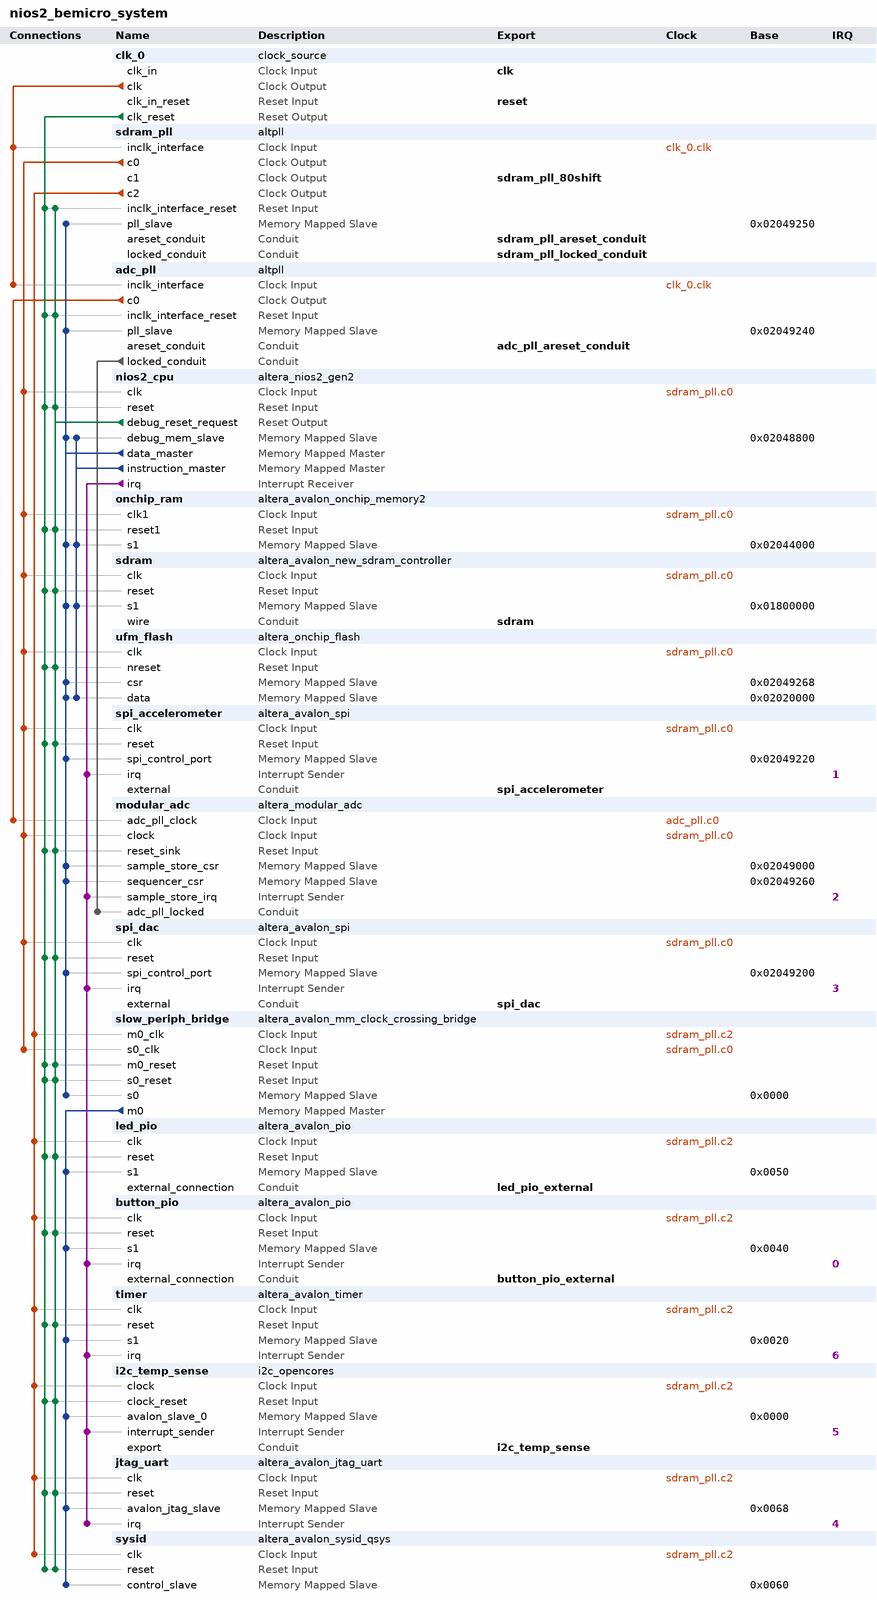
[diagram p0: system contents]
# Platform Designer (Qsys) system nios2_bemicro_system, MAX 10 10M08DAF484C8GES
# Parameters at their usual value, and those the tool derives, are not listed.
package require -exact qsys 16.0
create_system nios2_bemicro_system
set_project_property DEVICE_FAMILY {MAX 10}
set_project_property DEVICE 10M08DAF484C8GES

add_instance clk_0 clock_source 16.0
set_instance_parameter_value clk_0 clockFrequency 50000000

add_instance sdram_pll altpll 16.0
set_instance_parameter_value sdram_pll CLK0_DIVIDE_BY 5
set_instance_parameter_value sdram_pll CLK0_MULTIPLY_BY 8
set_instance_parameter_value sdram_pll CLK1_DIVIDE_BY 5
set_instance_parameter_value sdram_pll CLK1_DUTY_CYCLE 50
set_instance_parameter_value sdram_pll CLK1_MULTIPLY_BY 8
set_instance_parameter_value sdram_pll CLK1_PHASE_SHIFT -3125
set_instance_parameter_value sdram_pll CLK2_DIVIDE_BY 5
set_instance_parameter_value sdram_pll CLK2_DUTY_CYCLE 50
set_instance_parameter_value sdram_pll CLK2_MULTIPLY_BY 4
set_instance_parameter_value sdram_pll CLK2_PHASE_SHIFT 0
set_instance_parameter_value sdram_pll INCLK0_INPUT_FREQUENCY 20000
set_instance_parameter_value sdram_pll PORT_ARESET PORT_USED
set_instance_parameter_value sdram_pll PORT_LOCKED PORT_USED
set_instance_parameter_value sdram_pll PORT_clk1 PORT_USED
set_instance_parameter_value sdram_pll PORT_clk2 PORT_USED
set_instance_parameter_value sdram_pll PORT_clk3 PORT_UNUSED

add_instance adc_pll altpll 16.0
set_instance_parameter_value adc_pll CLK0_DIVIDE_BY 5
set_instance_parameter_value adc_pll CLK0_MULTIPLY_BY 1
set_instance_parameter_value adc_pll INCLK0_INPUT_FREQUENCY 20000
set_instance_parameter_value adc_pll PORT_ARESET PORT_USED
set_instance_parameter_value adc_pll PORT_LOCKED PORT_USED
set_instance_parameter_value adc_pll PORT_clk1 PORT_UNUSED
set_instance_parameter_value adc_pll PORT_clk2 PORT_UNUSED
set_instance_parameter_value adc_pll PORT_clk3 PORT_UNUSED

add_instance nios2_cpu altera_nios2_gen2 16.0
set_instance_parameter_value nios2_cpu dcache_size 2048
set_instance_parameter_value nios2_cpu debug_hwbreakpoint 2
set_instance_parameter_value nios2_cpu exceptionSlave onchip_ram.s1
set_instance_parameter_value nios2_cpu icache_size 4096
set_instance_parameter_value nios2_cpu impl Tiny
set_instance_parameter_value nios2_cpu resetSlave onchip_ram.s1

add_instance onchip_ram altera_avalon_onchip_memory2 16.0
set_instance_parameter_value onchip_ram dataWidth 32
set_instance_parameter_value onchip_ram dualPort false
set_instance_parameter_value onchip_ram initMemContent false
set_instance_parameter_value onchip_ram initializationFileName onchip_mem.hex
set_instance_parameter_value onchip_ram memorySize 16384

add_instance sdram altera_avalon_new_sdram_controller 16.0
set_instance_parameter_value sdram TAC 5.4
set_instance_parameter_value sdram TRCD 15.0
set_instance_parameter_value sdram TRP 15.0
set_instance_parameter_value sdram casLatency 2
set_instance_parameter_value sdram columnWidth 8
set_instance_parameter_value sdram dataWidth 16
set_instance_parameter_value sdram generateSimulationModel false
set_instance_parameter_value sdram model single_Micron_MT48LC4M32B2_7_chip
set_instance_parameter_value sdram numberOfBanks 4
set_instance_parameter_value sdram numberOfChipSelects 1
set_instance_parameter_value sdram powerUpDelay 100.0
set_instance_parameter_value sdram refreshPeriod 15.625
set_instance_parameter_value sdram rowWidth 12

add_instance ufm_flash altera_onchip_flash 16.0
set_instance_parameter_value ufm_flash CLOCK_FREQUENCY 80.0
set_instance_parameter_value ufm_flash CONFIGURATION_MODE {Single Uncompressed Image}
set_instance_parameter_value ufm_flash SECTOR_ACCESS_MODE {Read and write,Read and write,Read only,Hidden,Hidden}
set_instance_parameter_value ufm_flash initFlashContent false
set_instance_parameter_value ufm_flash initializationFileName altera_onchip_flash.hex
set_instance_parameter_value ufm_flash useNonDefaultInitFile false

add_instance spi_accelerometer altera_avalon_spi 16.0
set_instance_parameter_value spi_accelerometer clockPolarity 0
set_instance_parameter_value spi_accelerometer dataWidth 8
set_instance_parameter_value spi_accelerometer masterSPI true
set_instance_parameter_value spi_accelerometer numberOfSlaves 1
set_instance_parameter_value spi_accelerometer targetClockRate 128000

add_instance modular_adc altera_modular_adc 16.0
set_instance_parameter_value modular_adc CLOCK_FREQ 80000000
set_instance_parameter_value modular_adc CORE_VAR 0
set_instance_parameter_value modular_adc DEVICE_PART 10M08DAF484C8GES
set_instance_parameter_value modular_adc clkdiv 2
set_instance_parameter_value modular_adc int_vref_vr 3.0
set_instance_parameter_value modular_adc refsel 0
set_instance_parameter_value modular_adc sample_rate 0
set_instance_parameter_value modular_adc seq_order_length 8
set_instance_parameter_value modular_adc seq_order_slot_1 1
set_instance_parameter_value modular_adc seq_order_slot_2 9
set_instance_parameter_value modular_adc seq_order_slot_3 2
set_instance_parameter_value modular_adc seq_order_slot_4 16
set_instance_parameter_value modular_adc seq_order_slot_5 3
set_instance_parameter_value modular_adc seq_order_slot_6 11
set_instance_parameter_value modular_adc seq_order_slot_7 4
set_instance_parameter_value modular_adc seq_order_slot_8 12
set_instance_parameter_value modular_adc use_ch0 false
set_instance_parameter_value modular_adc use_ch11 true
set_instance_parameter_value modular_adc use_ch12 true
set_instance_parameter_value modular_adc use_ch16 true
set_instance_parameter_value modular_adc use_ch2 true
set_instance_parameter_value modular_adc use_ch3 true
set_instance_parameter_value modular_adc use_ch4 true
set_instance_parameter_value modular_adc use_ch5 false
set_instance_parameter_value modular_adc use_ch6 false
set_instance_parameter_value modular_adc use_ch7 false
set_instance_parameter_value modular_adc use_ch8 false
set_instance_parameter_value modular_adc use_ch9 true
set_instance_parameter_value modular_adc use_tsd false

add_instance spi_dac altera_avalon_spi 16.0
set_instance_parameter_value spi_dac clockPolarity 0
set_instance_parameter_value spi_dac dataWidth 8
set_instance_parameter_value spi_dac masterSPI true
set_instance_parameter_value spi_dac numberOfSlaves 1
set_instance_parameter_value spi_dac targetClockRate 128000

add_instance slow_periph_bridge altera_avalon_mm_clock_crossing_bridge 16.0
set_instance_parameter_value slow_periph_bridge ADDRESS_UNITS WORDS
set_instance_parameter_value slow_periph_bridge ADDRESS_WIDTH 10
set_instance_parameter_value slow_periph_bridge COMMAND_FIFO_DEPTH 8
set_instance_parameter_value slow_periph_bridge DATA_WIDTH 32
set_instance_parameter_value slow_periph_bridge MASTER_SYNC_DEPTH 2
set_instance_parameter_value slow_periph_bridge MAX_BURST_SIZE 1
set_instance_parameter_value slow_periph_bridge RESPONSE_FIFO_DEPTH 32
set_instance_parameter_value slow_periph_bridge SLAVE_SYNC_DEPTH 2
set_instance_parameter_value slow_periph_bridge USE_AUTO_ADDRESS_WIDTH 0

add_instance led_pio altera_avalon_pio 16.0
set_instance_parameter_value led_pio direction Output
set_instance_parameter_value led_pio width 8

add_instance button_pio altera_avalon_pio 16.0
set_instance_parameter_value button_pio captureEdge true
set_instance_parameter_value button_pio direction Input
set_instance_parameter_value button_pio edgeType FALLING
set_instance_parameter_value button_pio generateIRQ true
set_instance_parameter_value button_pio irqType EDGE
set_instance_parameter_value button_pio simDoTestBenchWiring true
set_instance_parameter_value button_pio simDrivenValue 15
set_instance_parameter_value button_pio width 4

add_instance timer altera_avalon_timer 16.0
set_instance_parameter_value timer period 1
set_instance_parameter_value timer periodUnits MSEC

add_instance i2c_temp_sense i2c_opencores 13.0

add_instance jtag_uart altera_avalon_jtag_uart 16.0
set_instance_parameter_value jtag_uart simInteractiveOptions NO_INTERACTIVE_WINDOWS

add_instance sysid altera_avalon_sysid_qsys 16.0
set_instance_parameter_value sysid id 0

# connections
add_connection adc_pll.c0 modular_adc.adc_pll_clock clock
add_connection clk_0.clk adc_pll.inclk_interface clock
add_connection clk_0.clk sdram_pll.inclk_interface clock
add_connection sdram_pll.c0 modular_adc.clock clock
add_connection sdram_pll.c0 nios2_cpu.clk clock
add_connection sdram_pll.c0 onchip_ram.clk1 clock
add_connection sdram_pll.c0 sdram.clk clock
add_connection sdram_pll.c0 slow_periph_bridge.s0_clk clock
add_connection sdram_pll.c0 spi_accelerometer.clk clock
add_connection sdram_pll.c0 spi_dac.clk clock
add_connection sdram_pll.c0 ufm_flash.clk clock
add_connection sdram_pll.c2 button_pio.clk clock
add_connection sdram_pll.c2 i2c_temp_sense.clock clock
add_connection sdram_pll.c2 jtag_uart.clk clock
add_connection sdram_pll.c2 led_pio.clk clock
add_connection sdram_pll.c2 slow_periph_bridge.m0_clk clock
add_connection sdram_pll.c2 sysid.clk clock
add_connection sdram_pll.c2 timer.clk clock
add_connection clk_0.clk_reset adc_pll.inclk_interface_reset reset
add_connection clk_0.clk_reset button_pio.reset reset
add_connection clk_0.clk_reset i2c_temp_sense.clock_reset reset
add_connection clk_0.clk_reset jtag_uart.reset reset
add_connection clk_0.clk_reset led_pio.reset reset
add_connection clk_0.clk_reset modular_adc.reset_sink reset
add_connection clk_0.clk_reset nios2_cpu.reset reset
add_connection clk_0.clk_reset onchip_ram.reset1 reset
add_connection clk_0.clk_reset sdram.reset reset
add_connection clk_0.clk_reset sdram_pll.inclk_interface_reset reset
add_connection clk_0.clk_reset slow_periph_bridge.m0_reset reset
add_connection clk_0.clk_reset slow_periph_bridge.s0_reset reset
add_connection clk_0.clk_reset spi_accelerometer.reset reset
add_connection clk_0.clk_reset spi_dac.reset reset
add_connection clk_0.clk_reset sysid.reset reset
add_connection clk_0.clk_reset timer.reset reset
add_connection clk_0.clk_reset ufm_flash.nreset reset
add_connection nios2_cpu.debug_reset_request adc_pll.inclk_interface_reset reset
add_connection nios2_cpu.debug_reset_request button_pio.reset reset
add_connection nios2_cpu.debug_reset_request i2c_temp_sense.clock_reset reset
add_connection nios2_cpu.debug_reset_request jtag_uart.reset reset
add_connection nios2_cpu.debug_reset_request led_pio.reset reset
add_connection nios2_cpu.debug_reset_request modular_adc.reset_sink reset
add_connection nios2_cpu.debug_reset_request nios2_cpu.reset reset
add_connection nios2_cpu.debug_reset_request onchip_ram.reset1 reset
add_connection nios2_cpu.debug_reset_request sdram.reset reset
add_connection nios2_cpu.debug_reset_request sdram_pll.inclk_interface_reset reset
add_connection nios2_cpu.debug_reset_request slow_periph_bridge.m0_reset reset
add_connection nios2_cpu.debug_reset_request slow_periph_bridge.s0_reset reset
add_connection nios2_cpu.debug_reset_request spi_accelerometer.reset reset
add_connection nios2_cpu.debug_reset_request spi_dac.reset reset
add_connection nios2_cpu.debug_reset_request sysid.reset reset
add_connection nios2_cpu.debug_reset_request timer.reset reset
add_connection nios2_cpu.debug_reset_request ufm_flash.nreset reset
add_connection nios2_cpu.data_master adc_pll.pll_slave avalon
set_connection_parameter_value nios2_cpu.data_master/adc_pll.pll_slave baseAddress 0x02049240
add_connection nios2_cpu.data_master modular_adc.sample_store_csr avalon
set_connection_parameter_value nios2_cpu.data_master/modular_adc.sample_store_csr baseAddress 0x02049000
add_connection nios2_cpu.data_master modular_adc.sequencer_csr avalon
set_connection_parameter_value nios2_cpu.data_master/modular_adc.sequencer_csr baseAddress 0x02049260
add_connection nios2_cpu.data_master nios2_cpu.debug_mem_slave avalon
set_connection_parameter_value nios2_cpu.data_master/nios2_cpu.debug_mem_slave baseAddress 0x02048800
add_connection nios2_cpu.data_master onchip_ram.s1 avalon
set_connection_parameter_value nios2_cpu.data_master/onchip_ram.s1 baseAddress 0x02044000
add_connection nios2_cpu.data_master sdram.s1 avalon
set_connection_parameter_value nios2_cpu.data_master/sdram.s1 baseAddress 0x01800000
add_connection nios2_cpu.data_master sdram_pll.pll_slave avalon
set_connection_parameter_value nios2_cpu.data_master/sdram_pll.pll_slave baseAddress 0x02049250
add_connection nios2_cpu.data_master slow_periph_bridge.s0 avalon
set_connection_parameter_value nios2_cpu.data_master/slow_periph_bridge.s0 baseAddress 0x0000
add_connection nios2_cpu.data_master spi_accelerometer.spi_control_port avalon
set_connection_parameter_value nios2_cpu.data_master/spi_accelerometer.spi_control_port baseAddress 0x02049220
add_connection nios2_cpu.data_master spi_dac.spi_control_port avalon
set_connection_parameter_value nios2_cpu.data_master/spi_dac.spi_control_port baseAddress 0x02049200
add_connection nios2_cpu.data_master ufm_flash.csr avalon
set_connection_parameter_value nios2_cpu.data_master/ufm_flash.csr baseAddress 0x02049268
add_connection nios2_cpu.data_master ufm_flash.data avalon
set_connection_parameter_value nios2_cpu.data_master/ufm_flash.data baseAddress 0x02020000
add_connection nios2_cpu.instruction_master nios2_cpu.debug_mem_slave avalon
set_connection_parameter_value nios2_cpu.instruction_master/nios2_cpu.debug_mem_slave baseAddress 0x02048800
add_connection nios2_cpu.instruction_master onchip_ram.s1 avalon
set_connection_parameter_value nios2_cpu.instruction_master/onchip_ram.s1 baseAddress 0x02044000
add_connection nios2_cpu.instruction_master sdram.s1 avalon
set_connection_parameter_value nios2_cpu.instruction_master/sdram.s1 baseAddress 0x01800000
add_connection nios2_cpu.instruction_master ufm_flash.data avalon
set_connection_parameter_value nios2_cpu.instruction_master/ufm_flash.data baseAddress 0x02020000
add_connection slow_periph_bridge.m0 button_pio.s1 avalon
set_connection_parameter_value slow_periph_bridge.m0/button_pio.s1 baseAddress 0x0040
add_connection slow_periph_bridge.m0 i2c_temp_sense.avalon_slave_0 avalon
set_connection_parameter_value slow_periph_bridge.m0/i2c_temp_sense.avalon_slave_0 baseAddress 0x0000
add_connection slow_periph_bridge.m0 jtag_uart.avalon_jtag_slave avalon
set_connection_parameter_value slow_periph_bridge.m0/jtag_uart.avalon_jtag_slave baseAddress 0x0068
add_connection slow_periph_bridge.m0 led_pio.s1 avalon
set_connection_parameter_value slow_periph_bridge.m0/led_pio.s1 baseAddress 0x0050
add_connection slow_periph_bridge.m0 sysid.control_slave avalon
set_connection_parameter_value slow_periph_bridge.m0/sysid.control_slave baseAddress 0x0060
add_connection slow_periph_bridge.m0 timer.s1 avalon
set_connection_parameter_value slow_periph_bridge.m0/timer.s1 baseAddress 0x0020
add_connection adc_pll.locked_conduit modular_adc.adc_pll_locked conduit
add_connection nios2_cpu.irq button_pio.irq interrupt
set_connection_parameter_value nios2_cpu.irq/button_pio.irq irqNumber 0
add_connection nios2_cpu.irq i2c_temp_sense.interrupt_sender interrupt
set_connection_parameter_value nios2_cpu.irq/i2c_temp_sense.interrupt_sender irqNumber 5
add_connection nios2_cpu.irq jtag_uart.irq interrupt
set_connection_parameter_value nios2_cpu.irq/jtag_uart.irq irqNumber 4
add_connection nios2_cpu.irq modular_adc.sample_store_irq interrupt
set_connection_parameter_value nios2_cpu.irq/modular_adc.sample_store_irq irqNumber 2
add_connection nios2_cpu.irq spi_accelerometer.irq interrupt
set_connection_parameter_value nios2_cpu.irq/spi_accelerometer.irq irqNumber 1
add_connection nios2_cpu.irq spi_dac.irq interrupt
set_connection_parameter_value nios2_cpu.irq/spi_dac.irq irqNumber 3
add_connection nios2_cpu.irq timer.irq interrupt
set_connection_parameter_value nios2_cpu.irq/timer.irq irqNumber 6

# exported interfaces
add_interface adc_pll_areset_conduit conduit end
set_interface_property adc_pll_areset_conduit EXPORT_OF adc_pll.areset_conduit
add_interface button_pio_external conduit end
set_interface_property button_pio_external EXPORT_OF button_pio.external_connection
add_interface clk clock sink
set_interface_property clk EXPORT_OF clk_0.clk_in
add_interface i2c_temp_sense conduit end
set_interface_property i2c_temp_sense EXPORT_OF i2c_temp_sense.export
add_interface led_pio_external conduit end
set_interface_property led_pio_external EXPORT_OF led_pio.external_connection
add_interface reset reset sink
set_interface_property reset EXPORT_OF clk_0.clk_in_reset
add_interface sdram conduit end
set_interface_property sdram EXPORT_OF sdram.wire
add_interface sdram_pll_80shift clock source
set_interface_property sdram_pll_80shift EXPORT_OF sdram_pll.c1
add_interface sdram_pll_areset_conduit conduit end
set_interface_property sdram_pll_areset_conduit EXPORT_OF sdram_pll.areset_conduit
add_interface sdram_pll_locked_conduit conduit end
set_interface_property sdram_pll_locked_conduit EXPORT_OF sdram_pll.locked_conduit
add_interface spi_accelerometer conduit end
set_interface_property spi_accelerometer EXPORT_OF spi_accelerometer.external
add_interface spi_dac conduit end
set_interface_property spi_dac EXPORT_OF spi_dac.external

set_interconnect_requirement {$system} qsys_mm.clockCrossingAdapter HANDSHAKE
set_interconnect_requirement {$system} qsys_mm.enableEccProtection FALSE
set_interconnect_requirement {$system} qsys_mm.insertDefaultSlave FALSE
set_interconnect_requirement {$system} qsys_mm.maxAdditionalLatency 1

save_system nios2_bemicro_system.qsys
